# Altium schematic sheet Connectors.SchDoc
size A4
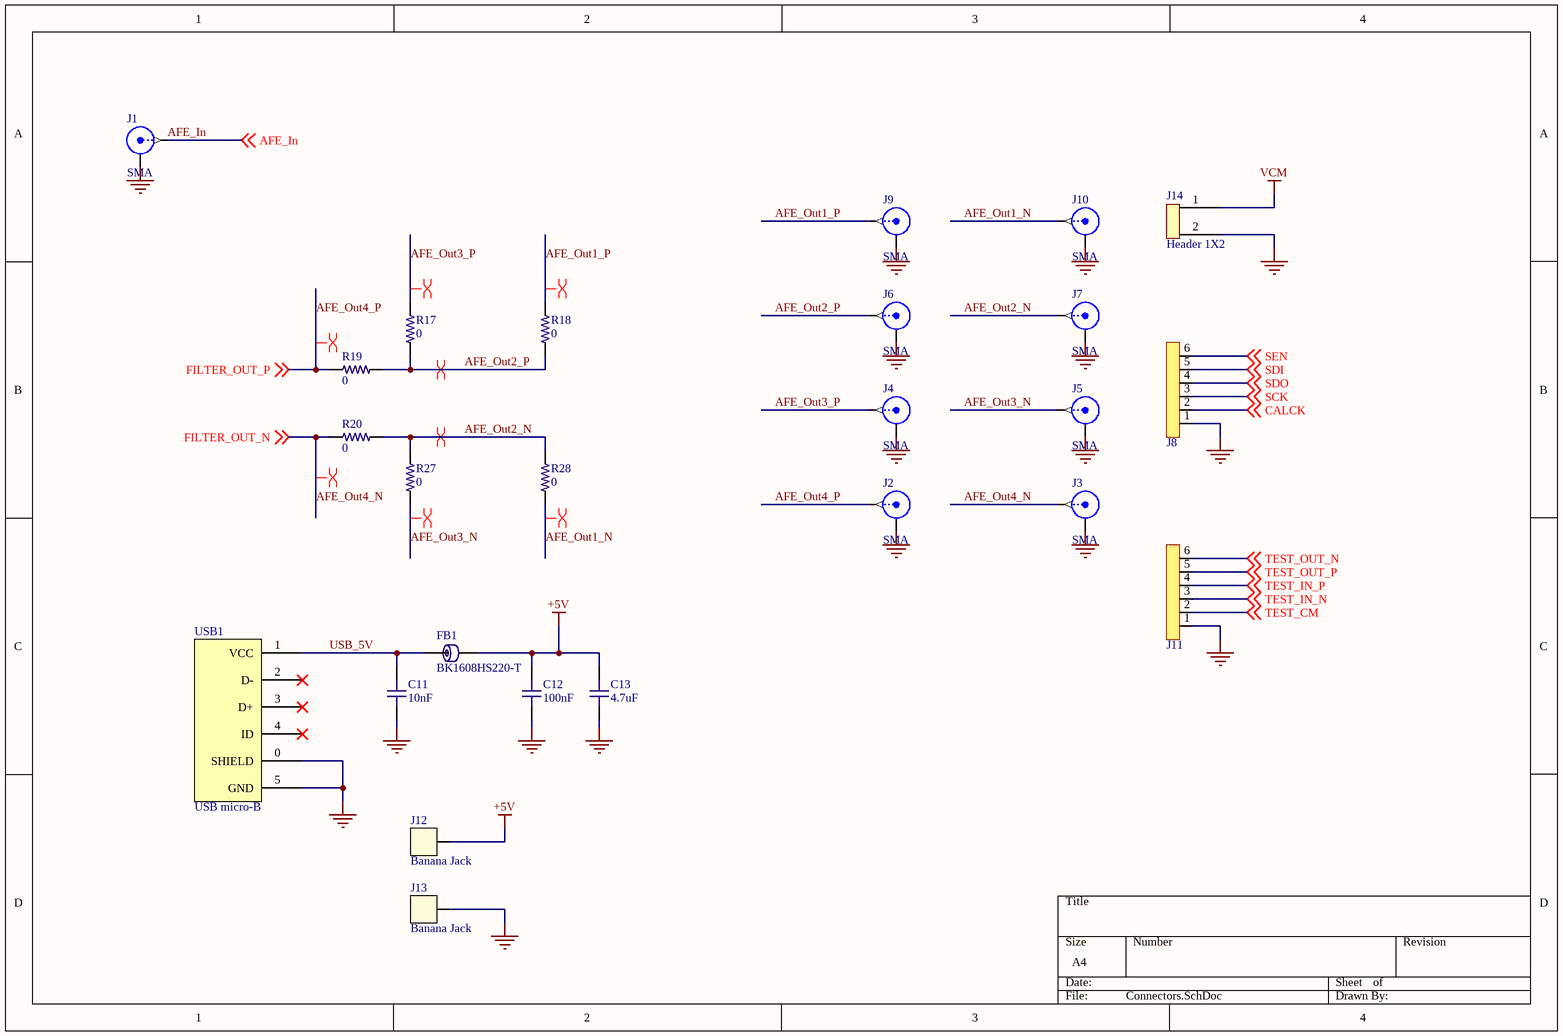
[diagram p0: Connectors.SchDoc]

## Parts
C11  value 10nF  [C0402-IPC]  (hidden comment: C0402 10nF 16V X7R)
C12  value 100nF  [C0402-IPC]  (hidden comment: C0402 100nF 16V X7R)
C13  value 4.7uF  [C0603-HIGH-DENSITY]  (hidden comment: 4.7uF, 25V, X5R, 0603)
FB1  BK1608HS220-T  [L0603]
J1  SMA  [SMA Edge Launch (Horizontal)]
J2  SMA  [SMA Edge Launch (Horizontal)]
J3  SMA  [SMA Edge Launch (Horizontal)]
J4  SMA  [SMA Edge Launch (Horizontal)]
J5  SMA  [SMA Edge Launch (Horizontal)]
J6  SMA  [SMA Edge Launch (Horizontal)]
J7  SMA  [SMA Edge Launch (Horizontal)]
J8  100 mil hdr 6 pos  [100MIL HDR 6 POS]  (value not drawn)
J9  SMA  [SMA Edge Launch (Horizontal)]
J10  SMA  [SMA Edge Launch (Horizontal)]
J11  100 mil hdr 6 pos  [100MIL HDR 6 POS]  (value not drawn)
J12  Banana Jack  [Banana Jack]
J13  Banana Jack  [Banana Jack]
J14  Header 1X2  [Header 1x2 TH Pitch 2.54mm]
R17  value 0  [R0603-IPC]  (hidden comment: R0603 0)
R18  value 0  [R0603-IPC]  (hidden comment: R0603 0)
R19  value 0  [R0603-IPC]  (hidden comment: R0603 0)
R20  value 0  [R0603-IPC]  (hidden comment: R0603 0)
R27  value 0  [R0603-IPC]  (hidden comment: R0603 0)
R28  value 0  [R0603-IPC]  (hidden comment: R0603 0)
USB1  USB micro-B  [USB-MicroB]

## Nets
+5V: C12.2 C13.2 FB1.2 J12.1
GND: C11.1 C12.1 C13.1 J1.2(Y) J2.2(Y) J3.2(Y) J4.2(Y) J5.2(Y) J6.2(Y) J7.2(Y) J8.1 J9.2(Y) J10.2(Y) J11.1 J13.1 J14.2 USB1.0(SHIELD) USB1.5(GND)
VCM: J14.1
AFE_In: J1.1(X) ; off-sheet AFE_In
AFE_Out1_N: J10.1(X) R28.1
AFE_Out1_P: J9.1(X) R18.2
AFE_Out2_N: J7.1(X) R20.2 R27.2 R28.2
AFE_Out2_P: J6.1(X) R17.1 R18.1 R19.2
AFE_Out3_N: J5.1(X) R27.1
AFE_Out3_P: J4.1(X) R17.2
AFE_Out4_N: J3.1(X) R20.1 ; off-sheet FILTER_OUT_N  [also labelled FILTER_OUT_N]
AFE_Out4_P: J2.1(X) R19.1 ; off-sheet FILTER_OUT_P  [also labelled FILTER_OUT_P]
CALCK: J8.2 ; off-sheet CALCK
SCK: J8.3 ; off-sheet SCK
SDI: J8.5 ; off-sheet SDI
SDO: J8.4 ; off-sheet SDO
SEN: J8.6 ; off-sheet SEN
TEST_CM: J11.2 ; off-sheet TEST_CM
TEST_IN_N: J11.3 ; off-sheet TEST_IN_N
TEST_IN_P: J11.4 ; off-sheet TEST_IN_P
TEST_OUT_N: J11.6 ; off-sheet TEST_OUT_N
TEST_OUT_P: J11.5 ; off-sheet TEST_OUT_P
USB_5V: C11.2 FB1.1 USB1.1(VCC)

Not connected (* = marked no-connect by the designer): USB1 2(D-)* 3(D+)* 4(ID)*

## Layout directives
differential pair: AFE_Out1_N, AFE_Out1_P, AFE_Out2_N, AFE_Out2_P, AFE_Out3_N, AFE_Out3_P, AFE_Out4_N, AFE_Out4_P

## Library data of the parts
C11 = C0402 10nF 16V X7R: Chip Capacitor, 0402, 10nF, 16V, X7R; EIA Code: X5R; Max. Voltage: 16V; Supplier 1: Digi-Key; Supplier Part Number 1: 490-1313-1-ND
C12 = C0402 100nF 16V X7R: Chip Capacitor, 0402, 100nF, 16V, X7R; EIA Code: X5R; Max. Voltage: 16V; Supplier 1: Digi-Key; Supplier Part Number 1: 490-6328-1-ND
C13 = C0603 4.7uF 25V X5R: Chip Capacitor, 0603, 4.7uF, 25V, X5R; EIA Code: X5R; Max. Voltage: 25V; Supplier 1: Digi-Key; Supplier 2: Mouser; Supplier 3: LCSC; Supplier Part Number 1: 490-7203-1-ND; Supplier Part Number 2: 81-GRM188R61E475KE1D; Supplier Part Number 3: C90057
FB1 = BK1608HS220-T: Ferrite Beads Multi-Layer 22Ohm 25% 100MHz 1.5A 0.05Ohm DCR 0603 T/R; Manufacturer: Taiyo Yuden; Impedance: 22R; DC Resistance (DCR): 50mR; Number of Lines: 1; Shielding: Shielded; Supplier 1: Digi-Key; Manufacturer Part Number: BK1608HS220-T; RoHS: Yes; Category: Ferrite Beads and Chips; Stock 1: 23669; Pricing 1: 1=0.10000, 10=0.07200, 25=0.06560, 50=0.05900, 100=0.04320, 250=0.03144, 500=0.02882, 1000=0.02489 (USD); Mount: Surface Mount; Case/Package: 0603; Number of Pins: 2; Core Material: Ferrite; Case Code (Metric): 1608; Case Code (Imperial): 0603; Min Operating Temperature: -55°C; Max Operating Temperature: 125°C; Package Quantity: 1; Packaging: Tape and Reel; Tolerance: 25%; Max DC Current: 1.5A; Termination: SMD/SMT; Test Frequency: 100MHz; Resistance: 50mR; Max Current Rating: 1.5A; Series: BK; Frequency: 100MHz; Length: 0.063inch; Width: 0.031inch; Height: 0.037inch; Depth: 0.95mm; RoHS Compliant: Yes; REACH SVHC: No SVHC; Lead Free: Lead Free; Halogen Free: Halogen Free; ComponentLink1URL: https://datasheet.ciiva.com/1011/bk1608hs220-t-ss-1011861.pdf?src-supplier=Digi-Key; ComponentLink1Description: https://datasheet.ciiva.com/1011/bk1608hs220-t-ss-1011861.pdf?src-supplier=Digi-Key; ComponentLink2URL: https://datasheet.ciiva.com/1011/mlci07-e-1011862.pdf?src-supplier=Digi-Key; ComponentLink2Description: https://datasheet.ciiva.com/1011/mlci07-e-1011862.pdf?src-supplier=Digi-Key; ComponentLink3URL: https://datasheet.ciiva.com/1011/mlci07-e-1011863.pdf?src-supplier=Digi-Key; ComponentLink3Description: https://datasheet.ciiva.com/1011/mlci07-e-1011863.pdf?src-supplier=Digi-Key; ComponentLink4URL: https://datasheet.ciiva.com/5821/mlci07-e-5821271.pdf?src-supplier=Farnell; ComponentLink4Description: https://datasheet.ciiva.com/5821/mlci07-e-5821271.pdf?src-supplier=Farnell; ComponentLink5URL: https://datasheet.ciiva.com/7620/1734576-7620028.pdf?src-supplier=Element14; ComponentLink5Description: https://datasheet.ciiva.com/7620/1734576-7620028.pdf?src-supplier=Element14; Supplier Part Number 1: 587-1869-1-ND
J1-J7 J9 J10 = SMA: SMA Connector; Supplier 1: Digi-Key; Supplier Part Number 1: A97594-ND
J8 J11 = 100 mil hdr 6 pos: Header, 100 mil, 6pos, tin; Supplier 1: Digi-Key; Supplier Part Number 1: A31116-ND
J12 J13 = Banana Jack: JACK NON-INSULATED .350"; Supplier 1: Digi-Key; Supplier Part Number 1: 36-575-8-ND
R17-R20 R27 R28 = R0603 0: RES SMD 0 OHM JUMPER 1/10W 0603; Supplier 1: Digi-Key; Supplier Part Number 1: RMCF0603ZT0R00CT-ND
USB1 = USB micro-B: CONN RCPT USB TYPE B 3A; Manufacturer Part Number: 629105150521; Manufacturer: Wurth Electronics Inc.; Supplier 1: Digi-Key; Supplier Part Number 1: 609-4616-1-ND